# EAGLE design Top (EAGLE 7.6.0)
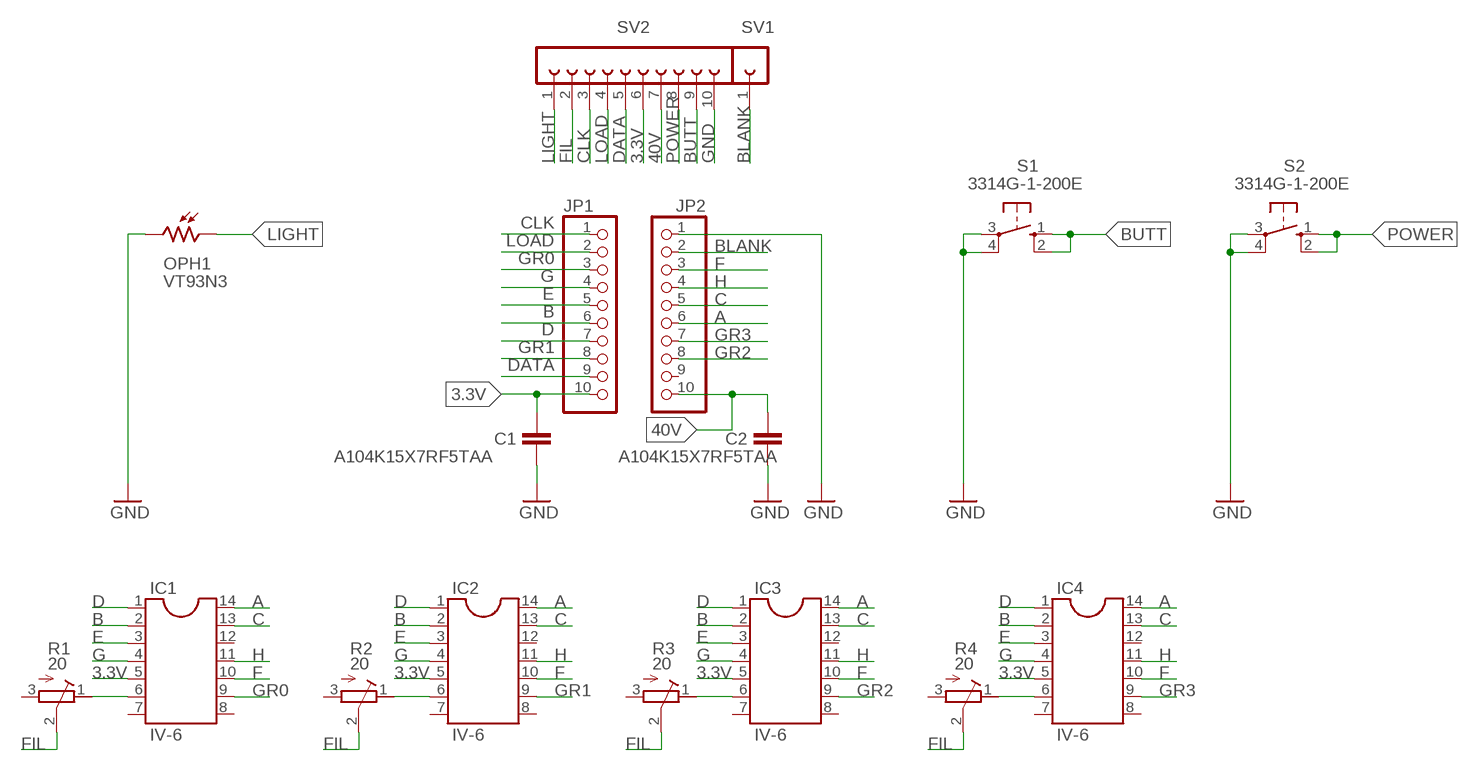
[diagram p0: schematic, sheet 1]

## Parts
C1  A104K15X7RF5TAA  [C025-025X050]
C2  A104K15X7RF5TAA  [C025-025X050]
IC1  IV-6  DIL14  [DIL14]
IC2  IV-6  DIL14  [DIL14]
IC3  IV-6  DIL14  [DIL14]
IC4  IV-6  DIL14  [DIL14]
JP1  PINHD-1X10  [1X10]
JP2  PINHD-1X10  [1X10]
OPH1  VT93N3  [VT900]
R1  20  R-TRIMM3314G  [RTRIM3314G]
R2  20  R-TRIMM3314G  [RTRIM3314G]
R3  20  R-TRIMM3314G  [RTRIM3314G]
R4  20  R-TRIMM3314G  [RTRIM3314G]
S1  3314G-1-200E  10-XX  [B3F-10XX]
S2  3314G-1-200E  10-XX  [B3F-10XX]
SV1  FE01  [FE05-1]
SV2  FE10-1  [FE10]

## Nets
3.3V: C1.1 IC1.5 IC2.5 IC3.5 IC4.5 JP1.10 SV2.6
40V: C2.1 JP2.10 SV2.7
A: IC1.14 IC2.14 IC3.14 IC4.14 JP2.6
B: IC1.2 IC2.2 IC3.2 IC4.2 JP1.6
BLANK: JP2.2 SV1.1
BUTT: S1.1(S) S1.2(S1) SV2.9
C: IC1.13 IC2.13 IC3.13 IC4.13 JP2.5
CLK: JP1.1 SV2.3
D: IC1.1 IC2.1 IC3.1 IC4.1 JP1.7
DATA: JP1.9 SV2.5
E: IC1.3 IC2.3 IC3.3 IC4.3 JP1.5
F: IC1.10 IC2.10 IC3.10 IC4.10 JP2.3
FIL: R1.2(S) R2.2(S) R3.2(S) R4.2(S) SV2.2
G: IC1.4 IC2.4 IC3.4 IC4.4 JP1.4
GND: C1.2 C2.2 JP2.1 OPH1.2 S1.3(P) S1.4(P1) S2.3(P) S2.4(P1) SV2.10
GR0: IC1.9 JP1.3
GR1: IC2.9 JP1.8
GR2: IC3.9 JP2.8
GR3: IC4.9 JP2.7
H: IC1.11 IC2.11 IC3.11 IC4.11 JP2.4
LIGHT: OPH1.1 SV2.1
LOAD: JP1.2 SV2.4
N$1: IC1.6 R1.1(E)
N$3: IC2.6 R2.1(E)
N$4: IC3.6 R3.1(E)
N$5: IC4.6 R4.1(E)
POWER: S2.1(S) S2.2(S1) SV2.8
Unconnected: IC1.7 IC1.8 IC1.12 IC2.7 IC2.8 IC2.12 IC3.7 IC3.8 IC3.12 IC4.7 IC4.8 IC4.12 JP2.9 R1.3(A) R2.3(A) R3.3(A) R4.3(A)

## Library data of the parts
C1 C2 = MyLib:A104K15X7RF5TAA
IC1-IC4 = ic-package:DIL14: Dual In Line / Socket
JP1 JP2 = pinhead:PINHD-1X10: PIN HEADER
OPH1 = photo-elements:VT9: Photoconductive Cell VT900 Series Source: http://optoelectronics.perkinelmer.com/content/Datasheets/DTS_vt900seriesdatasheet.pdf
R1-R4 = resistor:R-TRIMM: Trimm resistor
S1 S2 = switch-omron:10-XX: OMRON SWITCH; MPN: B3F-1000; OC_FARNELL: 176432; OC_NEWARK: 36M3542
SV1 = MyLib:FE01: FEMALE HEADER; OC_FARNELL: unknown; OC_NEWARK: unknown
SV2 = con-lsta:FE10-1: FEMALE HEADER; OC_FARNELL: unknown; OC_NEWARK: unknown

## Board
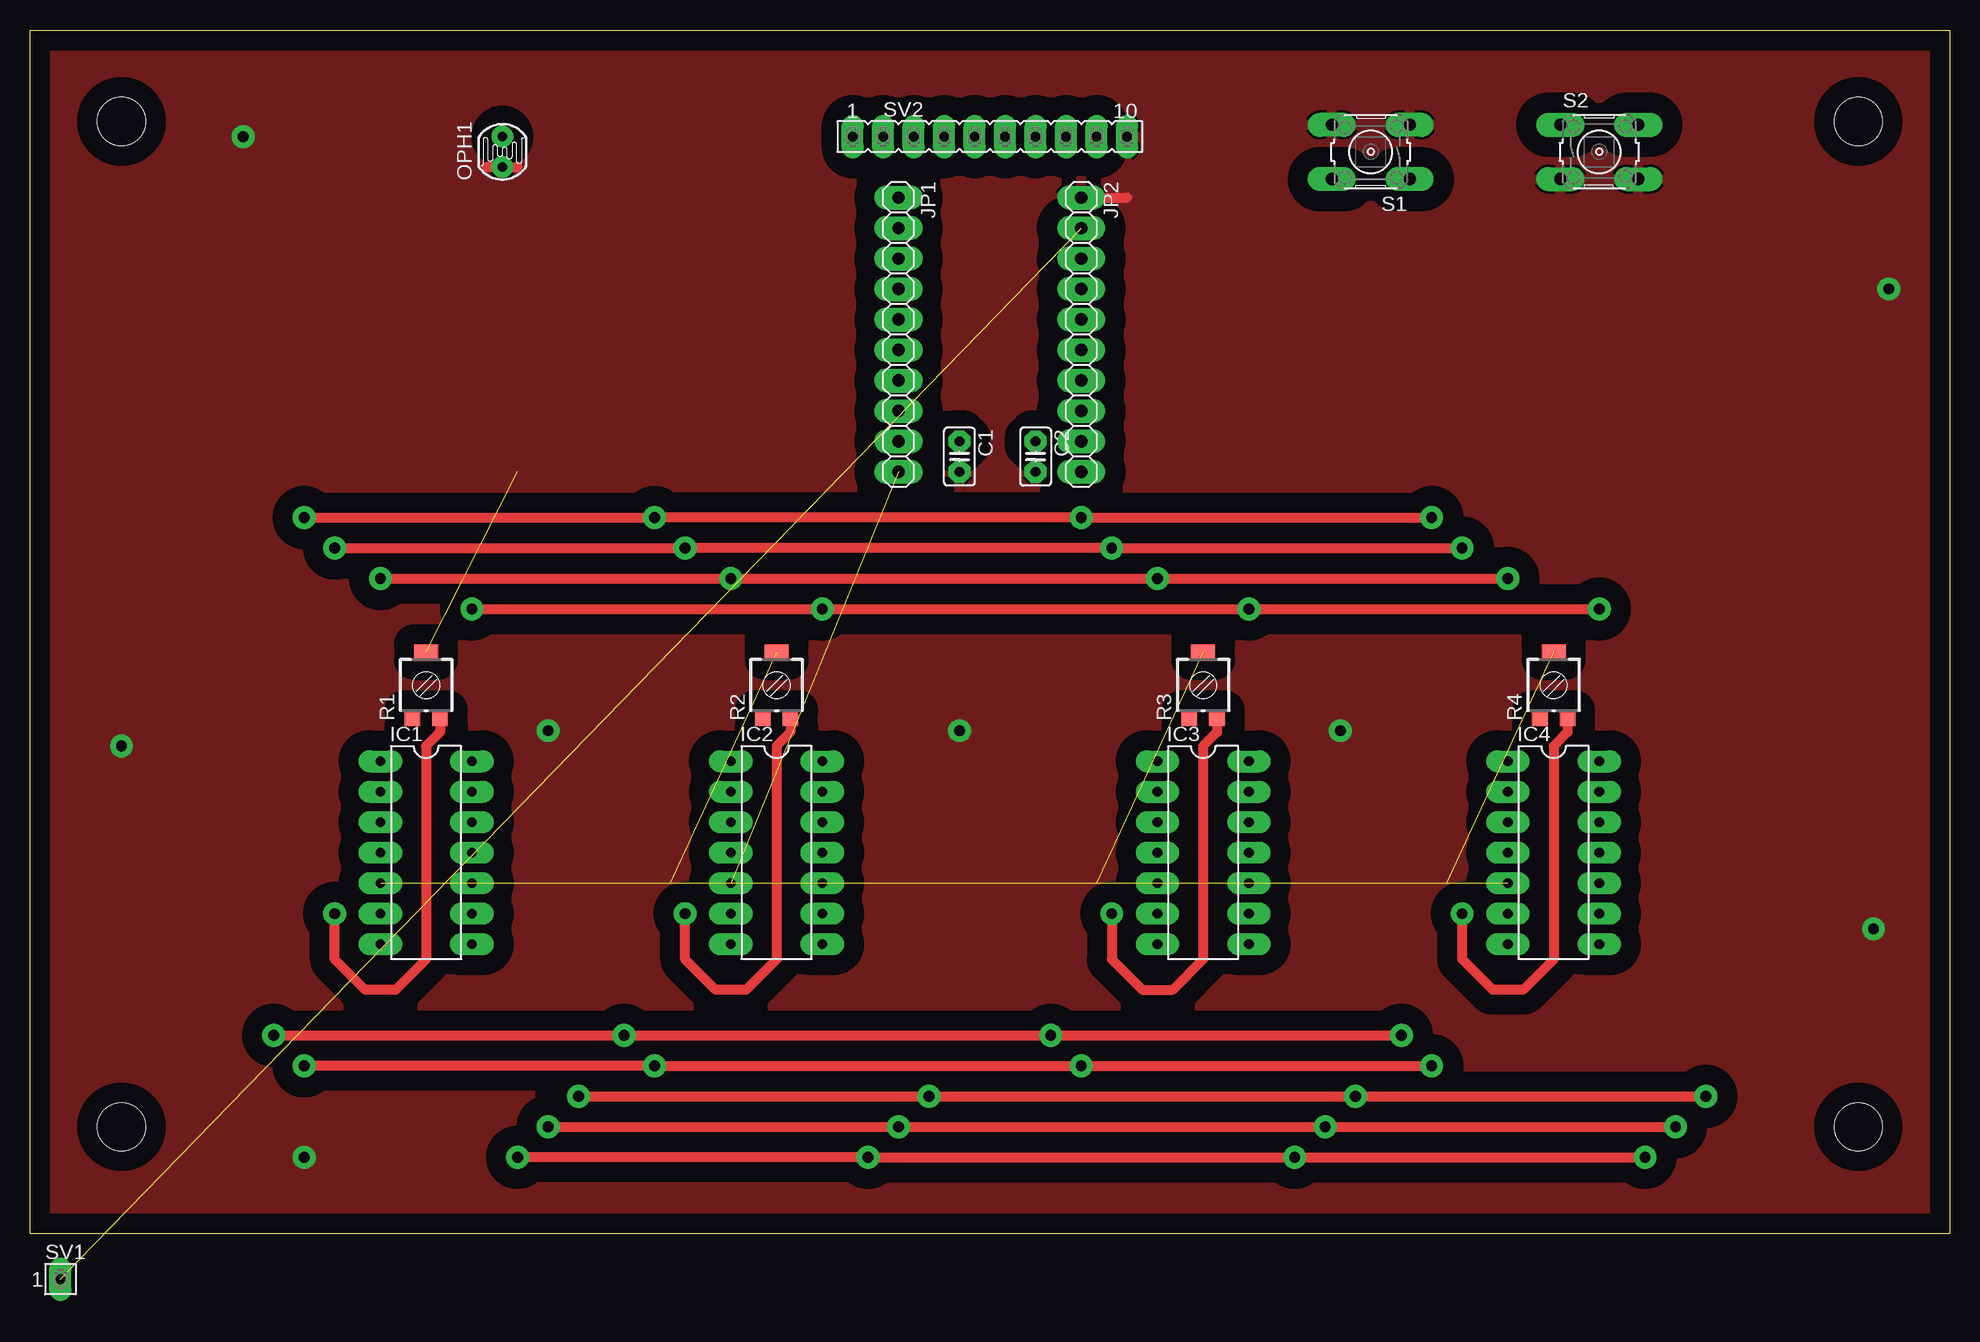
[diagram p1: board, top side]
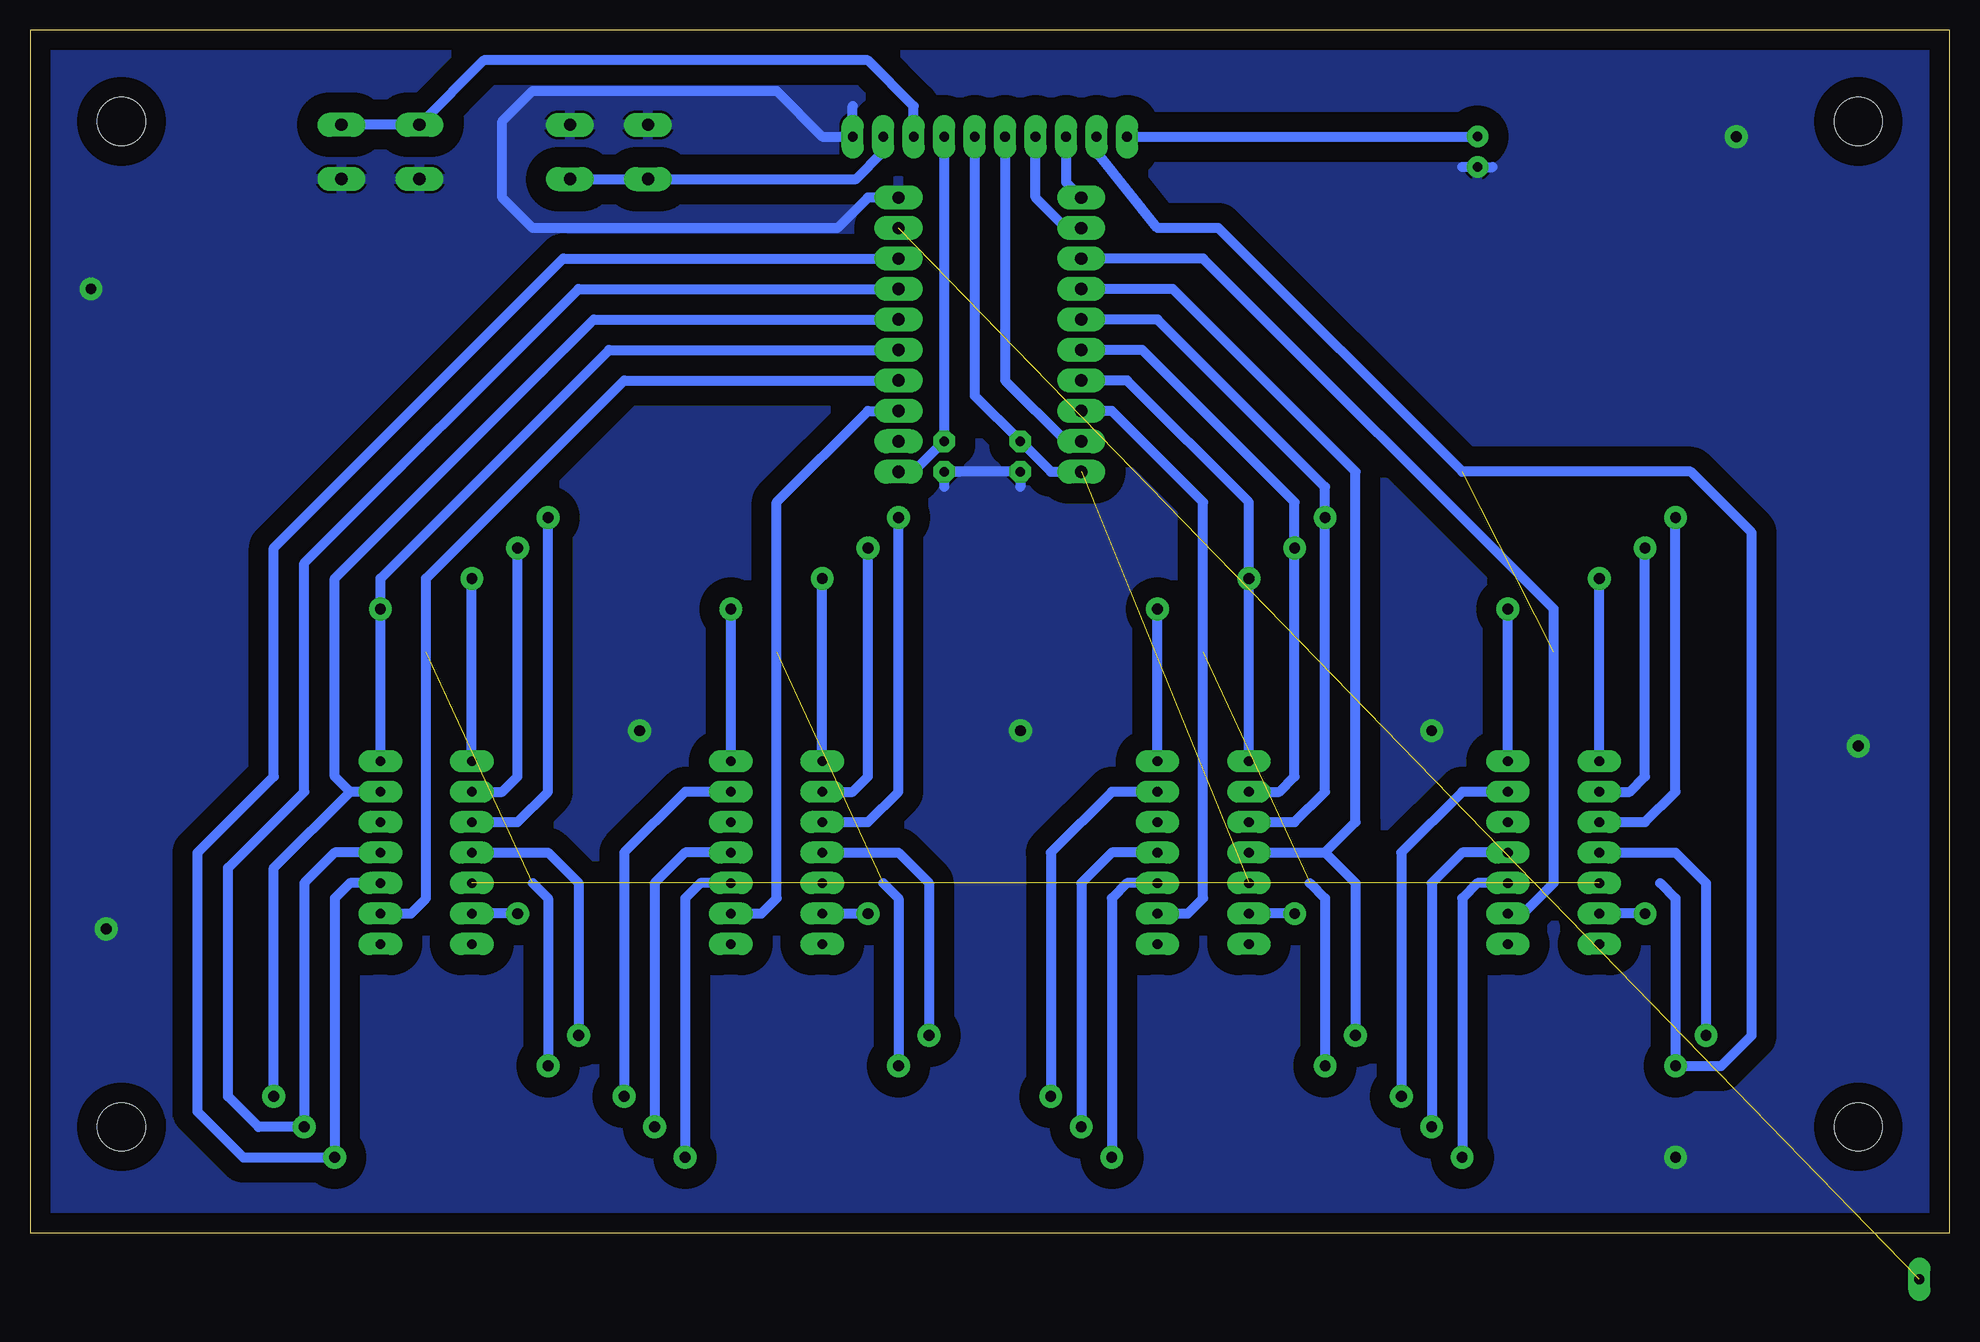
[diagram p2: board, bottom side, seen from below]

Size 160.02 x 100.33 mm. Coordinates in mm from the lower left corner, seen from the top.
Outline: 160,0 0,0 0,100.33 160.02,100.33 160.02,0
Copper layers (1*16): Top 0.035mm / dielectric 1.5mm / Bottom 0.035mm
Design rules "Line_Follower_Rules2": minimum track width 0.25mm, minimum drill 0.8mm, track to track 0.25mm, track to pad 0.25mm, pad to pad 0.25mm, via to via 0.25mm, smd to smd 5mil, copper to edge 1mm, drill to drill 0.5mm, minimum pad ring 0.5mm, minimum via ring 0.5mm, stop-mask expansion 4mil, vias tented up to drill 0mil, thermal gap 0.2mm
Holes 4 mm at 7.62,92.71 152.4,92.71 7.62,8.89 152.4,8.89

### Footprints (pad centres in the part's own frame; a part is rotated, then mirrored left to right if it is on the bottom)
C025-025X050 = drill 0.813 octagon: 1 -1.27,0; 2 1.27,0
DIL14 = drill 0.813 long: 1 -7.62,-3.81; 2 -5.08,-3.81; 3 -2.54,-3.81; 4 0,-3.81; 5 2.54,-3.81; 6 5.08,-3.81; 7 7.62,-3.81; 8 7.62,3.81; 9 5.08,3.81; 10 2.54,3.81; 11 0,3.81; 12 -2.54,3.81; 13 -5.08,3.81; 14 -7.62,3.81
1X10 = drill 1.016 long: 1 -11.43,0; 2 -8.89,0; 3 -6.35,0; 4 -3.81,0; 5 -1.27,0; 6 1.27,0; 7 3.81,0; 8 6.35,0; 9 8.89,0; 10 11.43,0
VT900 = drill 0.8 pad 1.4: 1 -1.27,0; 2 1.27,0
RTRIM3314G = smd 1.3 x 1.3: 1 1.15,-2.75; 3 -1.15,-2.75 | smd 2 x 1.3: 2 0,2.75
B3F-10XX = drill 1.016 long: 1 -3.251,2.261; 2 3.251,2.261; 3 -3.251,-2.261; 4 3.251,-2.261
FE05-1 = drill 0.813 long: 1 0,0
FE10 = drill 0.813 long: 1 -11.43,0; 2 -8.89,0; 3 -6.35,0; 4 -3.81,0; 5 -1.27,0; 6 1.27,0; 7 3.81,0; 8 6.35,0; 9 8.89,0; 10 11.43,0

### Placement (x,y rotation side)
C1  77.47,64.77 270 top
C2  83.82,64.77 270 top
IC1  33.02,31.75 270 top
IC2  62.23,31.75 270 top
IC3  97.79,31.75 270 top
IC4  127,31.75 270 top
JP1  72.39,74.93 270 top
JP2  87.63,74.93 270 top
OPH1  39.37,90.17 270 top
R1  33.02,45.72 0 top
R2  62.23,45.72 0 top
R3  97.79,45.72 0 top
R4  127,45.72 0 top
S1  111.76,90.17 180 top
S2  130.81,90.17 0 top
SV1  2.54,-3.81 0 top  (outside the outline)
SV2  80.01,91.44 0 top

### Tracks (layer width: path | path; a pad name or v marks a point on that pad's centre or on a via)
3.3V  (4 unrouted)
  Bottom 0.813: SV2.6 81.28,69.85 C1.1 74.93,63.5 JP1.10
40V
  Bottom 0.813: JP2.10 86.36,63.5 C2.1 SV2.7
A  (via drill 0.9 pad 1.78)
  Top 0.813: v36.83,52.07 v66.04,52.07 v101.6,52.07 v130.81,52.07
  Bottom 0.813: IC2.14 v66.04,52.07 | IC3.14 v101.6,52.07 | IC4.14 v130.81,52.07 130.81,54.61 111.76,73.66 JP2.6 | IC1.14 v36.83,52.07
B  (via drill 0.9 pad 1.78)
  Top 0.813: v25.4,57.15 v54.61,57.15 v90.17,57.15 v119.38,57.15
  Bottom 0.813: IC2.2 55.88,36.83 54.61,38.1 v54.61,57.15 54.61,60.96 67.31,73.66 JP1.6 | IC4.2 120.65,36.83 119.38,38.1 v119.38,57.15 | IC3.2 91.44,36.83 90.17,38.1 v90.17,57.15 | IC1.2 26.67,36.83 25.4,38.1 v25.4,57.15
BLANK  (1 unrouted)
BUTT
  Bottom 0.813: S1.1 S1.2 91.16,87.91 88.9,90.17 SV2.9
C  (via drill 0.9 pad 1.78)
  Top 0.813: v45.72,11.43 v74.93,11.43 v110.49,11.43 v139.7,11.43
  Bottom 0.813: IC1.13 40.64,36.83 45.72,31.75 v45.72,11.43 | IC2.13 69.85,36.83 74.93,31.75 v74.93,11.43 | IC4.13 133.35,36.83 | IC3.13 105.41,36.83 110.49,31.75 v110.49,11.43 | v139.7,11.43 139.7,30.48 133.35,36.83 | 133.35,36.83 134.62,38.1 134.62,54.61 113.03,76.2 JP2.5
CLK
  Bottom 0.813: SV2.3 73.66,87.63 JP1.1
D  (via drill 0.9 pad 1.78)
  Top 0.813: v29.21,54.61 v58.42,54.61 v93.98,54.61 v123.19,54.61
  Bottom 0.813: IC2.1 v58.42,54.61 58.42,60.96 68.58,71.12 JP1.7 | IC4.1 v123.19,54.61 | IC3.1 v93.98,54.61 | IC1.1 v29.21,54.61
DATA
  Bottom 0.813: JP1.9 73.66,66.04 78.74,71.12 SV2.5
E  (via drill 0.9 pad 1.78)
  Top 0.813: v22.86,59.69 v52.07,59.69 v87.63,59.69 v116.84,59.69
  Bottom 0.813: IC2.3 54.61,34.29 52.07,36.83 v52.07,59.69 52.07,62.23 66.04,76.2 JP1.5 | IC3.3 90.17,34.29 87.63,36.83 v87.63,59.69 | IC4.3 119.38,34.29 116.84,36.83 v116.84,59.69 | IC1.3 25.4,34.29 22.86,36.83 v22.86,59.69
F  (via drill 0.9 pad 1.78)
  Top 0.813: v40.64,6.35 v69.85,6.35 v105.41,6.35 v134.62,6.35
  Bottom 0.813: IC1.10 39.37,29.21 40.64,27.94 v40.64,6.35 | IC2.10 68.58,29.21 69.85,27.94 v69.85,6.35 | IC4.10 133.35,29.21 134.62,27.94 v134.62,6.35 142.24,6.35 146.05,10.16 146.05,31.75 139.7,38.1 139.7,57.15 115.57,81.28 JP2.3 | IC3.10 104.14,29.21 105.41,27.94 v105.41,6.35
FIL  (via drill 0.9 pad 1.78)  (4 unrouted)
  Top 0.813: v116.84,13.97 v87.63,13.97 v52.07,13.97 v22.86,13.97
  Bottom 0.813: 118.11,29.21 116.84,27.94 v116.84,13.97 | 88.9,29.21 87.63,27.94 v87.63,13.97 | 24.13,29.21 22.86,27.94 v22.86,13.97 19.05,13.97 16.51,16.51 16.51,58.42 21.59,63.5 40.64,63.5 60.96,83.82 66.04,83.82 71.12,90.17 SV2.2 | 53.34,29.21 52.07,27.94 v52.07,13.97
G  (via drill 0.9 pad 1.78)
  Top 0.813: v20.32,16.51 v49.53,16.51 v85.09,16.51 v114.3,16.51
  Bottom 0.813: 52.07,31.75 49.53,29.21 v49.53,16.51 | IC4.4 116.84,31.75 114.3,29.21 v114.3,16.51 | IC3.4 87.63,31.75 85.09,29.21 v85.09,16.51 | IC1.4 22.86,31.75 20.32,29.21 v20.32,16.51 | IC2.4 52.07,31.75 | 52.07,31.75 49.53,34.29 49.53,63.5 64.77,78.74 JP1.4
GND  (via drill 0.9 pad 1.78)
  Top 0.813: 38.1,88.9 OPH1.2 40.64,88.9 | JP2.1 91.44,86.36
  Bottom 0.813: 38.1,88.9 OPH1.2 40.64,88.9 | 77.47,62.23 C1.2 C2.2 | C2.2 83.82,62.23 | C2.2 82.55,63.5 | JP2.1 90.17,86.36 92.71,83.82 118.11,83.82 120.65,86.36 120.65,92.71 118.11,95.25 97.79,95.25 93.98,91.44 SV2.10 91.44,93.98
  other vias: 17.78,91.44 7.62,40.64 22.86,6.35 153.67,25.4 154.94,78.74 43.18,41.91 77.47,41.91 109.22,41.91
  pour Bottom (isolate 1.676): 0,100.33 160.02,100.33 160.02,0 0,0
  pour Top (isolate 1.676): 0,100.33 160.02,100.33 160.02,0 0,0
GR0
  Bottom 0.813: IC1.9 35.56,26.67 33.02,29.21 33.02,52.07 62.23,81.28 JP1.3
GR1
  Bottom 0.813: IC2.9 63.5,26.67 62.23,27.94 62.23,60.96 69.85,68.58 JP1.8
GR2
  Bottom 0.813: IC3.9 99.06,26.67 97.79,27.94 97.79,60.96 90.17,68.58 JP2.8
GR3
  Bottom 0.813: IC4.9 128.27,26.67 127,27.94 127,54.61 110.49,71.12 JP2.7
H  (via drill 0.9 pad 1.78)
  Top 0.813: v43.18,8.89 v72.39,8.89 v107.95,8.89 v137.16,8.89
  Bottom 0.813: IC1.11 40.64,31.75 43.18,29.21 v43.18,8.89 | IC2.11 69.85,31.75 72.39,29.21 v72.39,8.89 | IC4.11 134.62,31.75 137.16,29.21 v137.16,8.89 140.97,8.89 143.51,11.43 143.51,30.48 137.16,36.83 137.16,55.88 114.3,78.74 JP2.4 | IC3.11 105.41,31.75 107.95,29.21 v107.95,8.89
LIGHT
  Bottom 0.813: SV2.1 OPH1.1
LOAD
  Bottom 0.813: JP1.2 73.66,83.82 76.2,86.36 SV2.4
N$1  (via drill 0.9 pad 1.78)
  Top 0.813: R1.1 34.17,41.79 33.02,40.64 33.02,22.86 30.48,20.32 27.94,20.32 25.4,22.86 v25.4,26.67
  Bottom 0.813: v25.4,26.67 IC1.6
N$3  (via drill 0.9 pad 1.78)
  Top 0.813: R2.1 63.38,41.79 62.23,40.64 62.23,22.86 59.69,20.32 57.15,20.32 54.61,22.86 v54.61,26.67
  Bottom 0.813: v54.61,26.67 IC2.6
N$4  (via drill 0.9 pad 1.78)
  Top 0.813: v90.17,26.67 90.17,22.86 92.71,20.32 95.25,20.32 97.79,22.86 97.79,40.64 98.94,41.79 R3.1
  Bottom 0.813: IC3.6 v90.17,26.67
N$5  (via drill 0.9 pad 1.78)
  Top 0.813: R4.1 128.15,41.79 127,40.64 127,22.86 124.46,20.32 121.92,20.32 119.38,22.86 v119.38,26.67
  Bottom 0.813: v119.38,26.67 IC4.6
POWER
  Bottom 0.813: SV2.8 86.36,93.98 90.17,97.79 122.2,97.79 S2.1 S2.2